# EAGLE design amplifier (EAGLE 9.5.1)
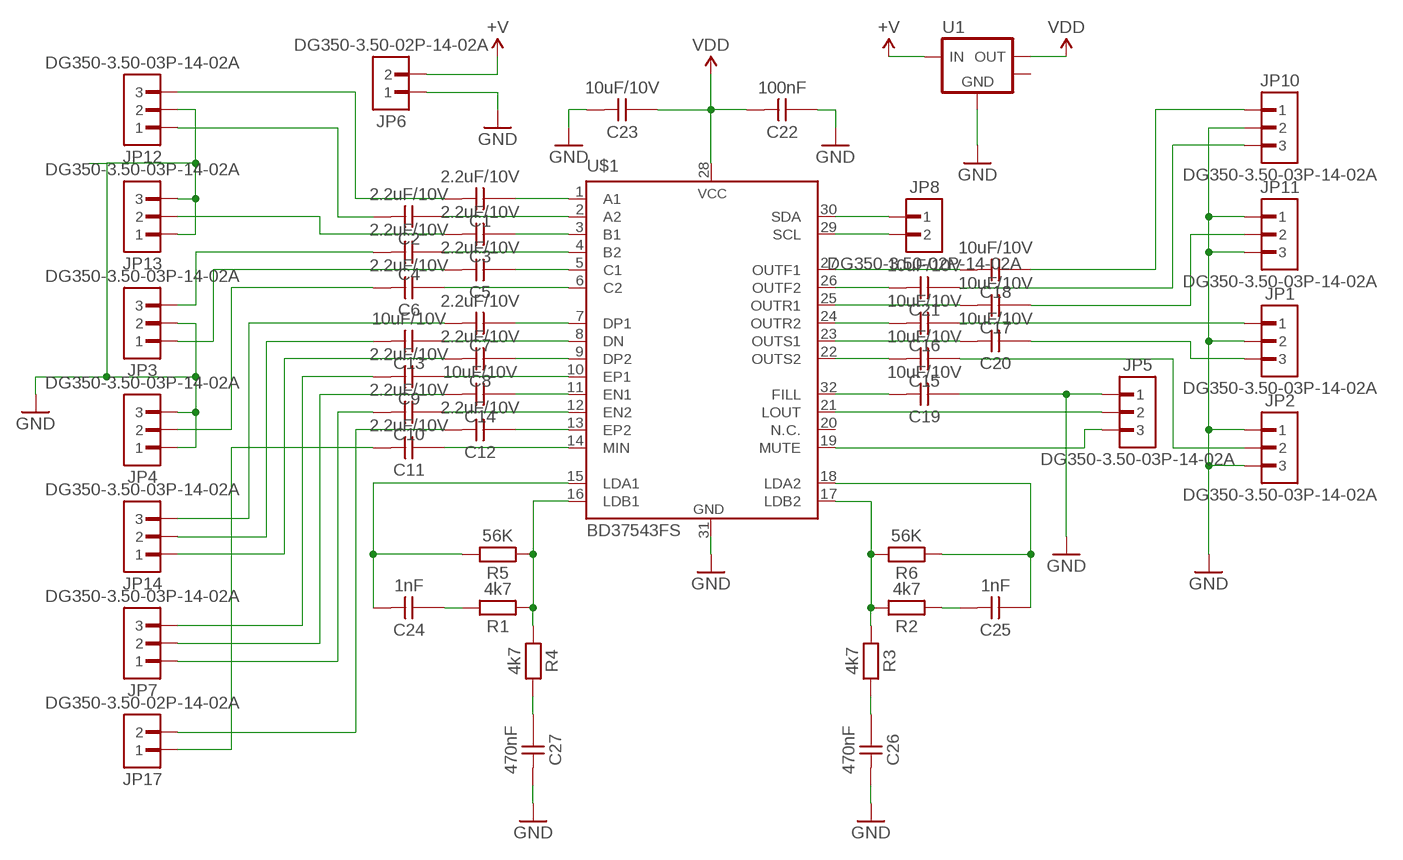
[diagram p0: schematic, sheet 1]

## Parts
C1  2.2uF/10V  C-0805-2.2UF-10V  [CAPACITOR-0805_R]
C2  2.2uF/10V  C-0805-2.2UF-10V  [CAPACITOR-0805_R]
C3  2.2uF/10V  C-0805-2.2UF-10V  [CAPACITOR-0805_R]
C4  2.2uF/10V  C-0805-2.2UF-10V  [CAPACITOR-0805_R]
C5  2.2uF/10V  C-0805-2.2UF-10V  [CAPACITOR-0805_R]
C6  2.2uF/10V  C-0805-2.2UF-10V  [CAPACITOR-0805_R]
C7  2.2uF/10V  C-0805-2.2UF-10V  [CAPACITOR-0805_R]
C8  2.2uF/10V  C-0805-2.2UF-10V  [CAPACITOR-0805_R]
C9  2.2uF/10V  C-0805-2.2UF-10V  [CAPACITOR-0805_R]
C10  2.2uF/10V  C-0805-2.2UF-10V  [CAPACITOR-0805_R]
C11  2.2uF/10V  C-0805-2.2UF-10V  [CAPACITOR-0805_R]
C12  2.2uF/10V  C-0805-2.2UF-10V  [CAPACITOR-0805_R]
C13  10uF/10V  C-0805-10UF-10V  [CAPACITOR-0805_R]
C14  10uF/10V  C-0805-10UF-10V  [CAPACITOR-0805_R]
C15  10uF/10V  C-0805-10UF-10V  [CAPACITOR-0805_R]
C16  10uF/10V  C-0805-10UF-10V  [CAPACITOR-0805_R]
C17  10uF/10V  C-0805-10UF-10V  [CAPACITOR-0805_R]
C18  10uF/10V  C-0805-10UF-10V  [CAPACITOR-0805_R]
C19  10uF/10V  C-0805-10UF-10V  [CAPACITOR-0805_R]
C20  10uF/10V  C-0805-10UF-10V  [CAPACITOR-0805_R]
C21  10uF/10V  C-0805-10UF-10V  [CAPACITOR-0805_R]
C22  100nF  C-0805-100NF  [CAPACITOR-0805_R]
C23  10uF/10V  C-0805-10UF-10V  [CAPACITOR-0805_R]
C24  1nF  C-0805-1NF  [CAPACITOR-0805_R]
C25  1nF  C-0805-1NF  [CAPACITOR-0805_R]
C26  470nF  C-0805-470NF  [CAPACITOR-0805_R]
C27  470nF  C-0805-470NF  [CAPACITOR-0805_R]
JP1  DG350-3.50-03P-14-02A  JP-DG350-3.50-03P-14-02A  [DG350-3.50-03P-14-02A_T]
JP2  DG350-3.50-03P-14-02A  JP-DG350-3.50-03P-14-02A  [DG350-3.50-03P-14-02A_T]
JP3  DG350-3.50-03P-14-02A  JP-DG350-3.50-03P-14-02A  [DG350-3.50-03P-14-02A_T]
JP4  DG350-3.50-03P-14-02A  JP-DG350-3.50-03P-14-02A  [DG350-3.50-03P-14-02A_T]
JP5  DG350-3.50-03P-14-02A  JP-DG350-3.50-03P-14-02A  [DG350-3.50-03P-14-02A_T]
JP6  DG350-3.50-02P-14-02A  JP-DG350-3.50-02P-14-02A  [DG350-3.50-02P-14-02A_T]
JP7  DG350-3.50-03P-14-02A  JP-DG350-3.50-03P-14-02A  [DG350-3.50-03P-14-02A_T]
JP8  DG350-3.50-02P-14-02A  JP-DG350-3.50-02P-14-02A  [DG350-3.50-02P-14-02A_T]
JP10  DG350-3.50-03P-14-02A  JP-DG350-3.50-03P-14-02A  [DG350-3.50-03P-14-02A_T]
JP11  DG350-3.50-03P-14-02A  JP-DG350-3.50-03P-14-02A  [DG350-3.50-03P-14-02A_T]
JP12  DG350-3.50-03P-14-02A  JP-DG350-3.50-03P-14-02A  [DG350-3.50-03P-14-02A_T]
JP13  DG350-3.50-03P-14-02A  JP-DG350-3.50-03P-14-02A  [DG350-3.50-03P-14-02A_T]
JP14  DG350-3.50-03P-14-02A  JP-DG350-3.50-03P-14-02A  [DG350-3.50-03P-14-02A_T]
JP17  DG350-3.50-02P-14-02A  JP-DG350-3.50-02P-14-02A  [DG350-3.50-02P-14-02A_T]
R1  4k7  R-0805-4K7  [RESISTOR-0805_R]
R2  4k7  R-0805-4K7  [RESISTOR-0805_R]
R3  4k7  R-0805-4K7  [RESISTOR-0805_R]
R4  4k7  R-0805-4K7  [RESISTOR-0805_R]
R5  56K  R-0805  [RESISTOR-0805_R]
R6  56K  R-0805  [RESISTOR-0805_R]
U1  LM2940KTT  [TO263-3]
U$1  BD37543FS  [SSOP32]

## Nets
+V: JP6.2 U1.1(VIN)
GND: C19.2 C22.2 C23.1 C26.1 C27.1 JP1.2 JP2.1 JP2.3 JP3.2 JP4.1 JP4.3 JP5.1 JP6.1 JP10.2 JP11.1 JP11.3 JP12.2 JP13.1 JP13.3 U1.2(GND) U$1.31(GND)
N$1: C1.2 U$1.1(A1)
N$2: C2.2 U$1.2(A2)
N$3: C3.2 U$1.3(B1)
N$4: C4.2 U$1.4(B2)
N$5: C5.2 U$1.5(C1)
N$6: C6.2 U$1.6(C2)
N$7: C7.2 U$1.7(DP1)
N$8: C13.2 U$1.8(DN)
N$9: C8.2 U$1.9(DP2)
N$10: C11.2 U$1.14(MIN)
N$11: C12.2 U$1.13(EP2)
N$12: C10.2 U$1.12(EN2)
N$13: C14.2 U$1.11(EN1)
N$14: C9.2 U$1.10(EP1)
N$15: C19.1 U$1.32(FILL)
N$16: C15.1 U$1.22(OUTS2)
N$17: C16.1 U$1.24(OUTR2)
N$18: C17.1 U$1.25(OUTR1)
N$19: C21.1 U$1.26(OUTF2)
N$20: C18.1 U$1.27(OUTF1)
N$21: R1.1 R4.1 R5.1 U$1.16(LDB1)
N$22: C24.1 R5.2 U$1.15(LDA1)
N$23: R2.2 R3.1 R6.2 U$1.17(LDB2)
N$24: C25.2 R6.1 U$1.18(LDA2)
N$25: C24.2 R1.2
N$26: C27.2 R4.2
N$27: C25.1 R2.1
N$28: C26.2 R3.2
N$29: JP8.1 U$1.30(SDA)
N$30: JP8.2 U$1.29(SCL)
N$31: JP5.2 U$1.21(LOUT)
N$32: C11.1 JP17.1
N$33: C15.2 JP2.2
N$34: C20.2 JP1.3
N$35: C16.2 JP1.1
N$36: C20.1 U$1.23(OUTS1)
N$37: C17.2 JP11.2
N$38: C21.2 JP10.3
N$39: C18.2 JP10.1
N$40: C1.1 JP12.3
N$41: C2.1 JP12.1
N$42: C3.1 JP13.2
N$43: C4.1 JP3.3
N$44: C5.1 JP3.1
N$45: C6.1 JP4.2
N$46: C7.1 JP14.3
N$47: C13.1 JP14.2
N$48: C8.1 JP14.1
N$49: C9.1 JP7.3
N$50: C14.1 JP7.2
N$51: C10.1 JP7.1
N$52: JP5.3 U$1.19(MUTE)
N$53: C12.1 JP17.2
VDD: C22.1 C23.2 U1.3(VOUT) U$1.28(VCC)
Unconnected: U1.TAB U$1.20(N.C.)

## Library data of the parts
C1-C12 = bc-capacitor:C-0805-2.2UF-10V: Capacitor 2.2uF 10% 10V X7R soft termination Package Description: 0805 Mounting Technology: SMT Supplier Name: JabloPCB Unit Price CZK: 1.5600; BCPN: BC-C-0805-2.2UF-10V
C13-C21 C23 = bc-capacitor:C-0805-10UF-10V: Capacitor 10uF 10% 10V X7R soft termination Package Description: 0805 Mounting Technology: SMT Supplier Name: JabloPCB Unit Price CZK: 1.3990; BCPN: BC-C-0805-10UF-10V
C22 = bc-capacitor:C-0805-100NF: Capacitor 100nF 10% ≥10V X7R Package Description: 0805 Mounting Technology: SMT Supplier Name: JabloPCB Unit Price CZK: 0.0770; BCPN: BC-C-0805-100NF
C24 C25 = bc-capacitor:C-0805-1NF: Capacitor 1nF 10% ≥10V X7R Part Status: BAT Package Description: 0805 Mounting Technology: SMT Supplier Name: JabloPCB Supplier Part Number: A+CSM-003.02 Unit Price CZK: 0.0840 L/T (weeks): 1; BCPN: BC-C-0805-1NF
C26 C27 = bc-capacitor:C-0805-470NF: Capacitor 470nF 10% ≥10V X7R Part Status: PIR Package Description: 0805 Mounting Technology: SMT Supplier Name: JabloPCB Unit Price CZK: 0.4000 L/T (weeks): 1; BCPN: BC-C-0805-470NF
JP1-JP5 JP7 JP10-JP14 = bc-connector:JP-DG350-3.50-03P-14-02A; BCPN: BC-JP-DG350-3.50-03P-14-02A
JP6 JP8 JP17 = bc-connector:JP-DG350-3.50-02P-14-02A: Screw terminal, 2-pin, pitch 3.5mm, 10A Part Status: Chester Mounting Technology: THT Manufacturer Name: Degson Manufacturer Part Number: DG350-3.50-02P-14-02A Supplier Name: Ecom Supplier Part Number: 07357 SVPS DG350-3,50-02P-14-02A Unit Price CZK: 1.8630 MPU (pcs): 1500; BCPN: BC-JP-DG350-3.50-02P-14-02A
R1-R4 = bc-resistor:R-0805-4K7: Resistor 4k7 1% 100ppm 125mW Part Status: Power Package Description: 0805 Mounting Technology: SMT Supplier Name: JabloPCB Unit Price CZK: 0.0500; BCPN: BC-R-0805-4K7
R5 R6 = bc-resistor:R-0805
U1 = bt_regulator:LM2940: LM2940 LDO Voltage Regulator Input Voltage Range = 6 V to 26 V Dropout Voltage Typically 0.5 V at IOUT = 1 A Reverse Battery Protection Internal Short Circuit Current Limit electrostatic discharge protection (±2kV) Tab is GND The LM2940-N/LM2940C positive voltage regulator features the ability to source 1A of output current with a dropout voltage of typically 0.5V and a maximum of 1V over the entire temperature range. Furthermore, a quiescent current reduction circuit has been included which reduces the ground current when the differential between the input voltage and the output exceeds approximately 3V. Designed also for vehicular applications, the LM2940-N/LM2940C and all regulated circuitry are protected from reverse battery installations or 2-battery jumps. During line transients, such as load dump when the input voltage can momentarily exceed the specified maximum operating voltage, the regulator will automatically shut down to protect both the internal circuits and the load. The LM2940/LM2940C cannot be harmed by temporary mirror-image insertion. Familiar regulator features such as short circuit and thermal overload protection are also provided. Datasheet.pdf <http://www.ti.com/lit/ds/symlink/lm2940-n.pdf>
U$1 = BD37543FS:BD37543FS

## Board
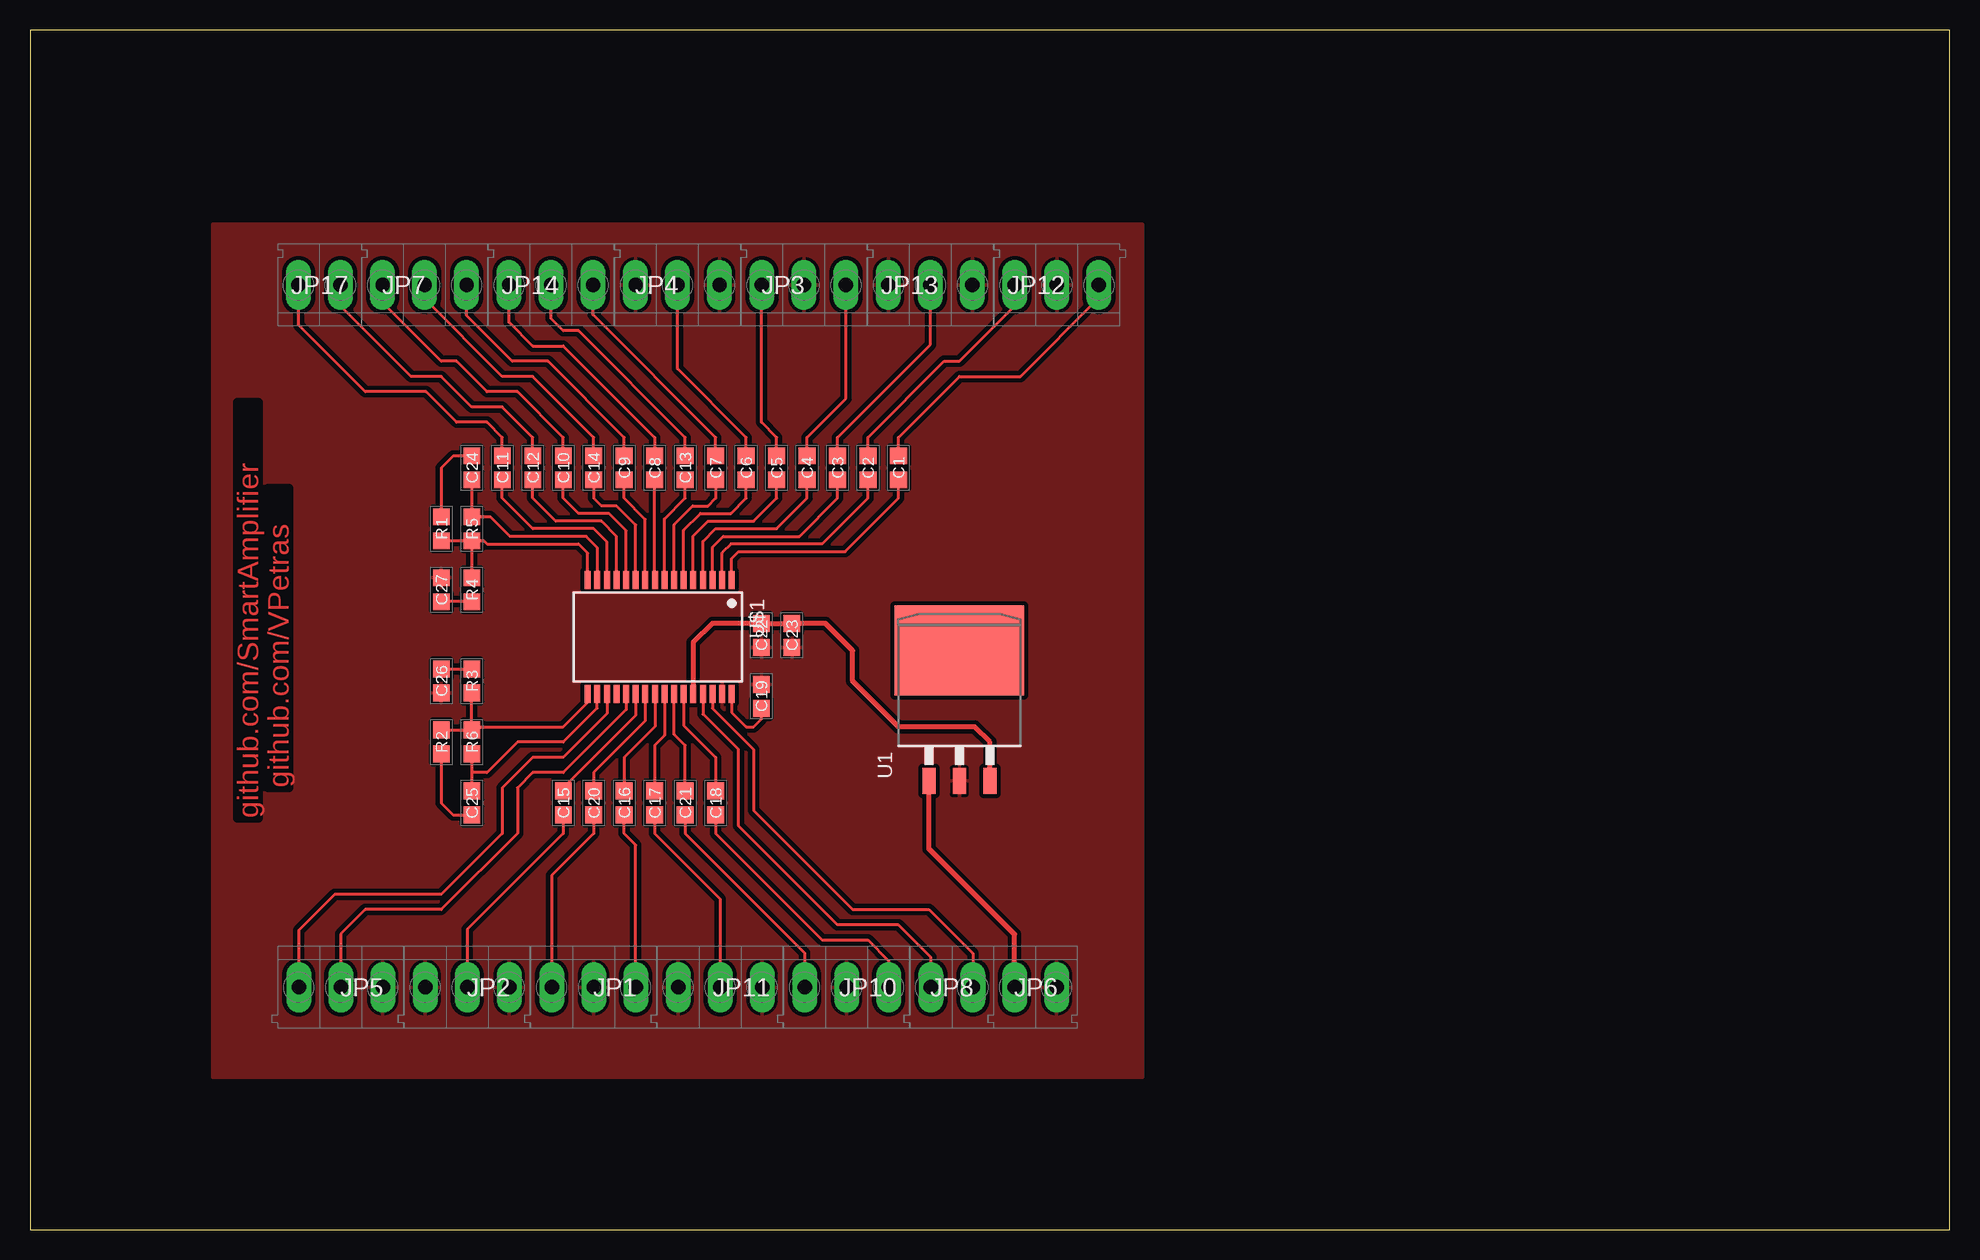
[diagram p1: board, top side]

Size 160 x 100 mm. Coordinates in mm from the lower left corner, seen from the top.
Outline: 0,0 160,0 160,100 0,100 0,0
Copper layers (1*16): Top 0.035mm / dielectric 1.5mm / Bottom 0.035mm
Design rules "default *": minimum track width 6mil, minimum drill 0.35mm, track to track 0.35mm, track to pad 0.35mm, pad to pad 0.35mm, via to via 0.35mm, smd to smd 6mil, copper to edge 40mil, drill to drill 6mil, minimum pad ring 10mil, minimum via ring 8mil, stop-mask expansion 4mil, vias tented up to drill 0mil, thermal gap 10mil

### Footprints (pad centres in the part's own frame; a part is rotated, then mirrored left to right if it is on the bottom)
CAPACITOR-0805_R = smd 1.4 x 1.4: 1 -1,0; 2 1,0
DG350-3.50-03P-14-02A_T = drill 1.2 pad 2.1 long: 1 -3.5,0; 2 0,0; 3 3.5,0
DG350-3.50-02P-14-02A_T = drill 1.2 pad 2.1 long: 1 -1.75,0; 2 1.75,0
RESISTOR-0805_R = smd 1.4 x 1.4: 1 -1,0; 2 1,0
TO263-3 = smd 1.067 x 2.159: 1 -2.54,-7.061; 2 0,-7.061; 3 2.54,-7.061 | smd 10.795 x 7.493: TAB 0,3.81
SSOP32 = smd 0.5 x 1.5: 1 -6.8,-4.75; 2 -6,-4.75; 3 -5.2,-4.75; 4 -4.4,-4.75; 5 -3.6,-4.75; 6 -2.8,-4.75; 7 -2,-4.75; 8 -1.2,-4.75; 9 -0.4,-4.75; 10 0.4,-4.75; 11 1.2,-4.75; 12 2,-4.75; 13 2.8,-4.75; 14 3.6,-4.75; 15 4.4,-4.75; 16 5.2,-4.75; 17 5.2,4.75; 18 4.4,4.75; 19 3.6,4.75; 20 2.8,4.75; 21 2,4.75; 22 1.2,4.75; 23 0.4,4.75; 24 -0.4,4.75; 25 -1.2,4.75; 26 -2,4.75; 27 -2.8,4.75; 28 -3.6,4.75; 29 -4.4,4.75; 30 -5.2,4.75; 31 -6,4.75; 32 -6.8,4.75

### Placement (x,y rotation side)
C1  72.39,63.5 270 top
C2  69.85,63.5 270 top
C3  67.31,63.5 270 top
C4  64.77,63.5 270 top
C5  62.23,63.5 270 top
C6  59.69,63.5 270 top
C7  57.15,63.5 270 top
C8  52.07,63.5 270 top
C9  49.53,63.5 270 top
C10  44.45,63.5 270 top
C11  39.37,63.5 270 top
C12  41.91,63.5 270 top
C13  54.61,63.5 270 top
C14  46.99,63.5 270 top
C15  44.45,35.56 270 top
C16  49.53,35.56 270 top
C17  52.07,35.56 270 top
C18  57.15,35.56 270 top
C19  60.96,44.45 90 top
C20  46.99,35.56 270 top
C21  54.61,35.56 270 top
C22  60.96,49.53 270 top
C23  63.5,49.53 90 top
C24  36.83,63.5 90 top
C25  36.83,35.56 90 top
C26  34.29,45.72 90 top
C27  34.29,53.34 270 top
JP1  46.99,20.19 180 top
JP2  36.45,20.19 180 top
JP3  64.52,78.74 0 top
JP4  53.98,78.74 0 top
JP5  25.91,20.19 180 top
JP6  83.82,20.19 180 top
JP7  32.89,78.74 0 top
JP8  76.83,20.19 180 top
JP10  68.07,20.19 180 top
JP11  57.53,20.19 180 top
JP12  85.6,78.74 0 top
JP13  75.06,78.74 0 top
JP14  43.43,78.74 0 top
JP17  24.13,78.74 0 top
R1  34.29,58.42 90 top
R2  34.29,40.64 90 top
R3  36.83,45.72 90 top
R4  36.83,53.34 270 top
R5  36.83,58.42 90 top
R6  36.83,40.64 90 top
U1  77.47,44.45 0 top
U$1  51.69,49.4 180 top

### Tracks (layer width: path | path; a pad name or v marks a point on that pad's centre or on a via)
+V
  Top 0.406: JP6.2 82.07,24.61 74.93,31.75 U1.1
GND
  pour Top: 15.24,83.82 15.24,12.7 21.59,12.7 92.71,12.7 92.71,83.82
N$1
  Top 0.254: U$1.1 58.49,55.95 59.05,56.52 67.94,56.52 72.39,60.96 C1.2
N$2
  Top 0.254: U$1.2 57.69,56.42 58.42,57.15 66.04,57.15 69.85,60.96 C2.2
N$3
  Top 0.254: U$1.3 56.89,56.89 57.78,57.78 64.14,57.78 67.31,60.96 C3.2
N$4
  Top 0.152: 64.77,62.23 C4.2
  Top 0.254: U$1.4 56.09,57.36 57.15,58.42 62.23,58.42 64.77,60.96 64.77,62.23
N$5
  Top 0.254: U$1.5 55.29,57.83 56.52,59.05 60.33,59.05 62.23,60.96 C5.2
N$6
  Top 0.254: U$1.6 54.49,58.3 55.88,59.69 58.42,59.69 59.69,60.96 C6.2
N$7
  Top 0.254: C7.2 57.15,60.96 56.52,60.33 55.24,60.33 53.69,58.77 U$1.7
N$8
  Top 0.254: U$1.8 52.89,59.24 54.61,60.96 C13.2
N$9
  Top 0.152: U$1.9 52.07,54.17
  Top 0.254: 52.07,54.17 C8.2
N$10
  Top 0.254: U$1.14 48.09,57.32 46.99,58.42 41.91,58.42 39.37,60.96 C11.2
N$11
  Top 0.254: U$1.13 48.89,57.79 47.62,59.05 43.81,59.05 41.91,60.96 C12.2
N$12
  Top 0.254: C10.2 44.45,60.96 45.72,59.69 48.26,59.69 49.69,58.26 U$1.12
N$13
  Top 0.254: C14.2 46.99,60.96 47.62,60.33 48.9,60.33 50.49,58.73 U$1.11
N$14
  Top 0.254: U$1.10 51.29,59.2 49.53,60.96 C9.2
N$15
  Top 0.254: U$1.32 58.49,43.11 59.69,41.91 60.33,41.91 60.96,42.55 C19.1
N$16
  Top 0.203: 44.45,36.83 C15.1
  Top 0.254: U$1.22 50.49,42.87 44.45,36.83
N$17
  Top 0.254: U$1.24 52.09,41.93 49.53,39.37 C16.1
N$18
  Top 0.254: U$1.25 52.89,41.19 52.07,40.37 C17.1
N$19
  Top 0.254: C21.1 54.61,40.37 53.69,41.29 U$1.26
N$20
  Top 0.254: U$1.27 54.49,42.03 57.15,39.37 C18.1
N$21
  Top 0.254: R1.1 R5.1 | R5.1 R4.1 | U$1.16 46.49,56.38 45.72,57.15 38.1,57.15 37.83,57.42 R5.1
N$22
  Top 0.254: U$1.15 47.29,56.85 46.35,57.78 40.01,57.78 38.37,59.42 R5.2 C24.1
N$23
  Top 0.203: R6.2 37.1,41.91
  Top 0.254: U$1.17 46.49,43.95 44.45,41.91 37.1,41.91 | R3.1 R6.2 R2.2
N$24
  Top 0.254: U$1.18 47.29,43.48 44.45,40.64 40.64,40.64 38.1,38.1 36.83,38.1 | 36.83,38.1 C25.2 | R6.1 36.83,38.1
N$25
  Top 0.254: C24.2 35.29,64.5 34.29,63.5 R1.2
N$26
  Top 0.254: R4.2 C27.2
N$27
  Top 0.254: R2.1 34.29,35.56 35.29,34.56 C25.1
N$28
  Top 0.254: C26.2 R3.2
N$29
  Top 0.254: U$1.30 56.89,43.44 60.33,40.01 60.33,34.92 68.58,26.67 74.93,26.67 78.58,23.02 JP8.1
N$30
  Top 0.254: U$1.29 56.09,42.97 59.05,40.01 59.05,33.66 67.31,25.4 72.39,25.4 75.08,22.7 JP8.2
N$31
  Top 0.254: U$1.21 49.69,43.34 44.45,38.1 41.91,38.1 40.64,36.83 40.64,33.02 34.29,26.67 27.94,26.67 25.91,24.64 JP5.2
N$32
  Top 0.254: C11.1 39.37,66.04 38.1,67.31 35.56,67.31 33.02,69.85 27.94,69.85 22.38,75.41 JP17.1
N$33
  Top 0.254: C15.2 44.45,33.02 36.45,25.02 JP2.2
N$34
  Top 0.254: C20.2 46.99,33.02 43.49,29.52 JP1.3
N$35
  Top 0.254: C16.2 49.53,33.02 50.49,32.06 JP1.1
N$36
  Top 0.254: U$1.23 51.29,42.4 46.99,38.1 C20.1
N$37
  Top 0.254: C17.2 52.07,33.02 57.53,27.56 JP11.2
N$38
  Top 0.254: C21.2 54.61,33.02 64.57,23.06 JP10.3
N$39
  Top 0.254: C18.2 57.15,33.02 66.04,24.13 69.85,24.13 71.57,22.41 JP10.1
N$40
  Top 0.254: C1.1 72.39,66.04 77.47,71.12 82.55,71.12 89.1,77.67 JP12.3
N$41
  Top 0.254: C2.1 69.85,66.04 76.2,72.39 77.47,72.39 82.1,77.02 JP12.1
N$42
  Top 0.254: JP13.2 75.06,73.79 67.31,66.04 C3.1
N$43
  Top 0.254: JP3.3 68.02,69.29 64.77,66.04 C4.1
N$44
  Top 0.254: JP3.1 60.96,78.68 60.96,67.31 62.23,66.04 C5.1
N$45
  Top 0.254: C6.1 59.69,66.04 53.98,71.75 JP4.2
N$46
  Top 0.254: C7.1 57.15,66.04 46.93,76.26 JP14.3
N$47
  Top 0.254: JP14.2 43.43,75.95 44.45,74.93 45.72,74.93 54.61,66.04 C13.1
N$48
  Top 0.254: JP14.1 39.93,75.64 41.91,73.66 44.45,73.66 52.07,66.04 C8.1
N$49
  Top 0.254: C9.1 49.53,66.04 43.18,72.39 40.2,72.39 36.39,76.2 JP7.3
N$50
  Top 0.254: JP7.2 32.89,77.6 39.37,71.12 41.91,71.12 46.99,66.04 C14.1
N$51
  Top 0.254: C10.1 44.45,66.04 40.64,69.85 38.1,69.85 35.56,72.39 34.29,72.39 29.39,77.29 JP7.1
N$52
  Top 0.254: U$1.19 48.09,43.01 44.45,39.37 41.91,39.37 39.37,36.83 39.37,33.02 34.29,27.94 25.4,27.94 22.41,24.95 JP5.3
N$53
  Top 0.254: C12.1 41.91,66.04 39.37,68.58 36.83,68.58 34.29,71.12 31.75,71.12 25.88,76.99 JP17.2
VDD
  Top 0.406: U$1.28 55.29,48.94 56.88,50.53 C22.1 C23.2 66.31,50.53 68.58,48.26 68.58,45.72 72.39,41.91 78.74,41.91 80.01,40.64 U1.3

### Text on the board
Top: github.com/VPetras | github.com/SmartAmplifier